# Altium schematic sheet 高压刺激电路.SchDoc
size C
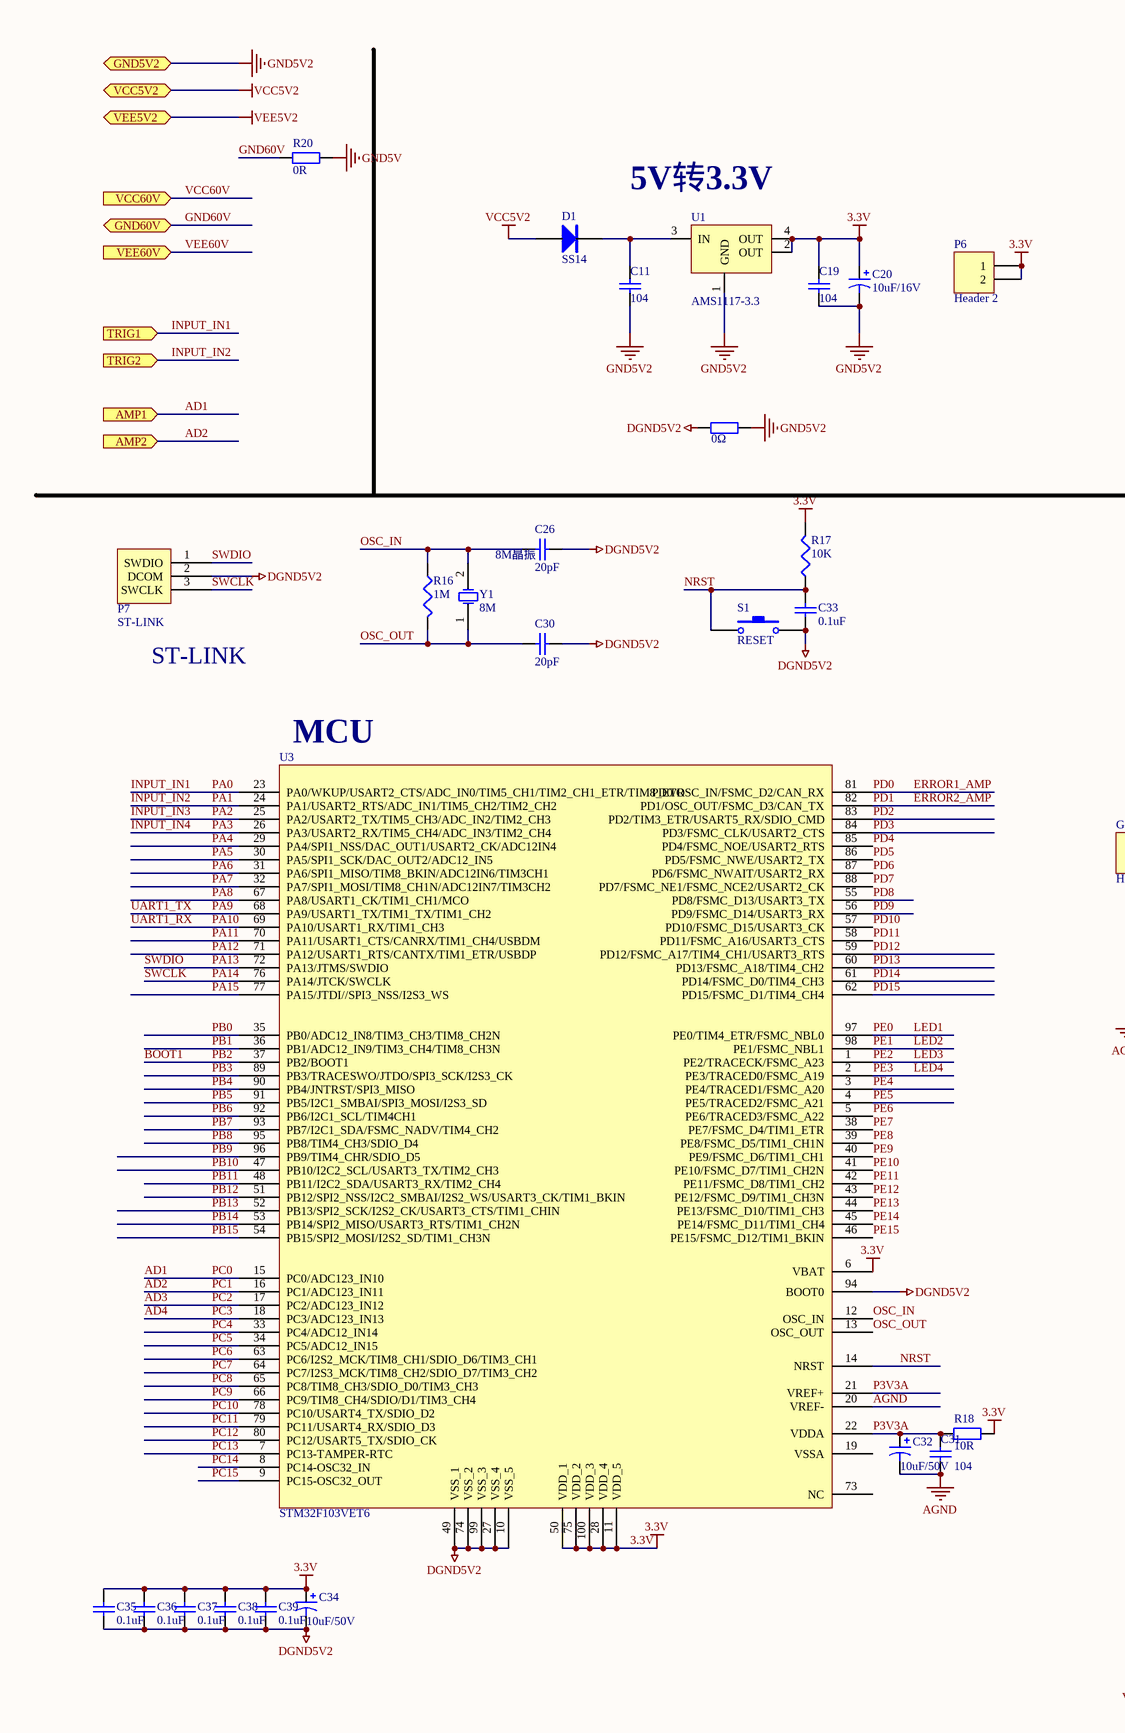
[diagram p0: 高压刺激电路.SchDoc, left]
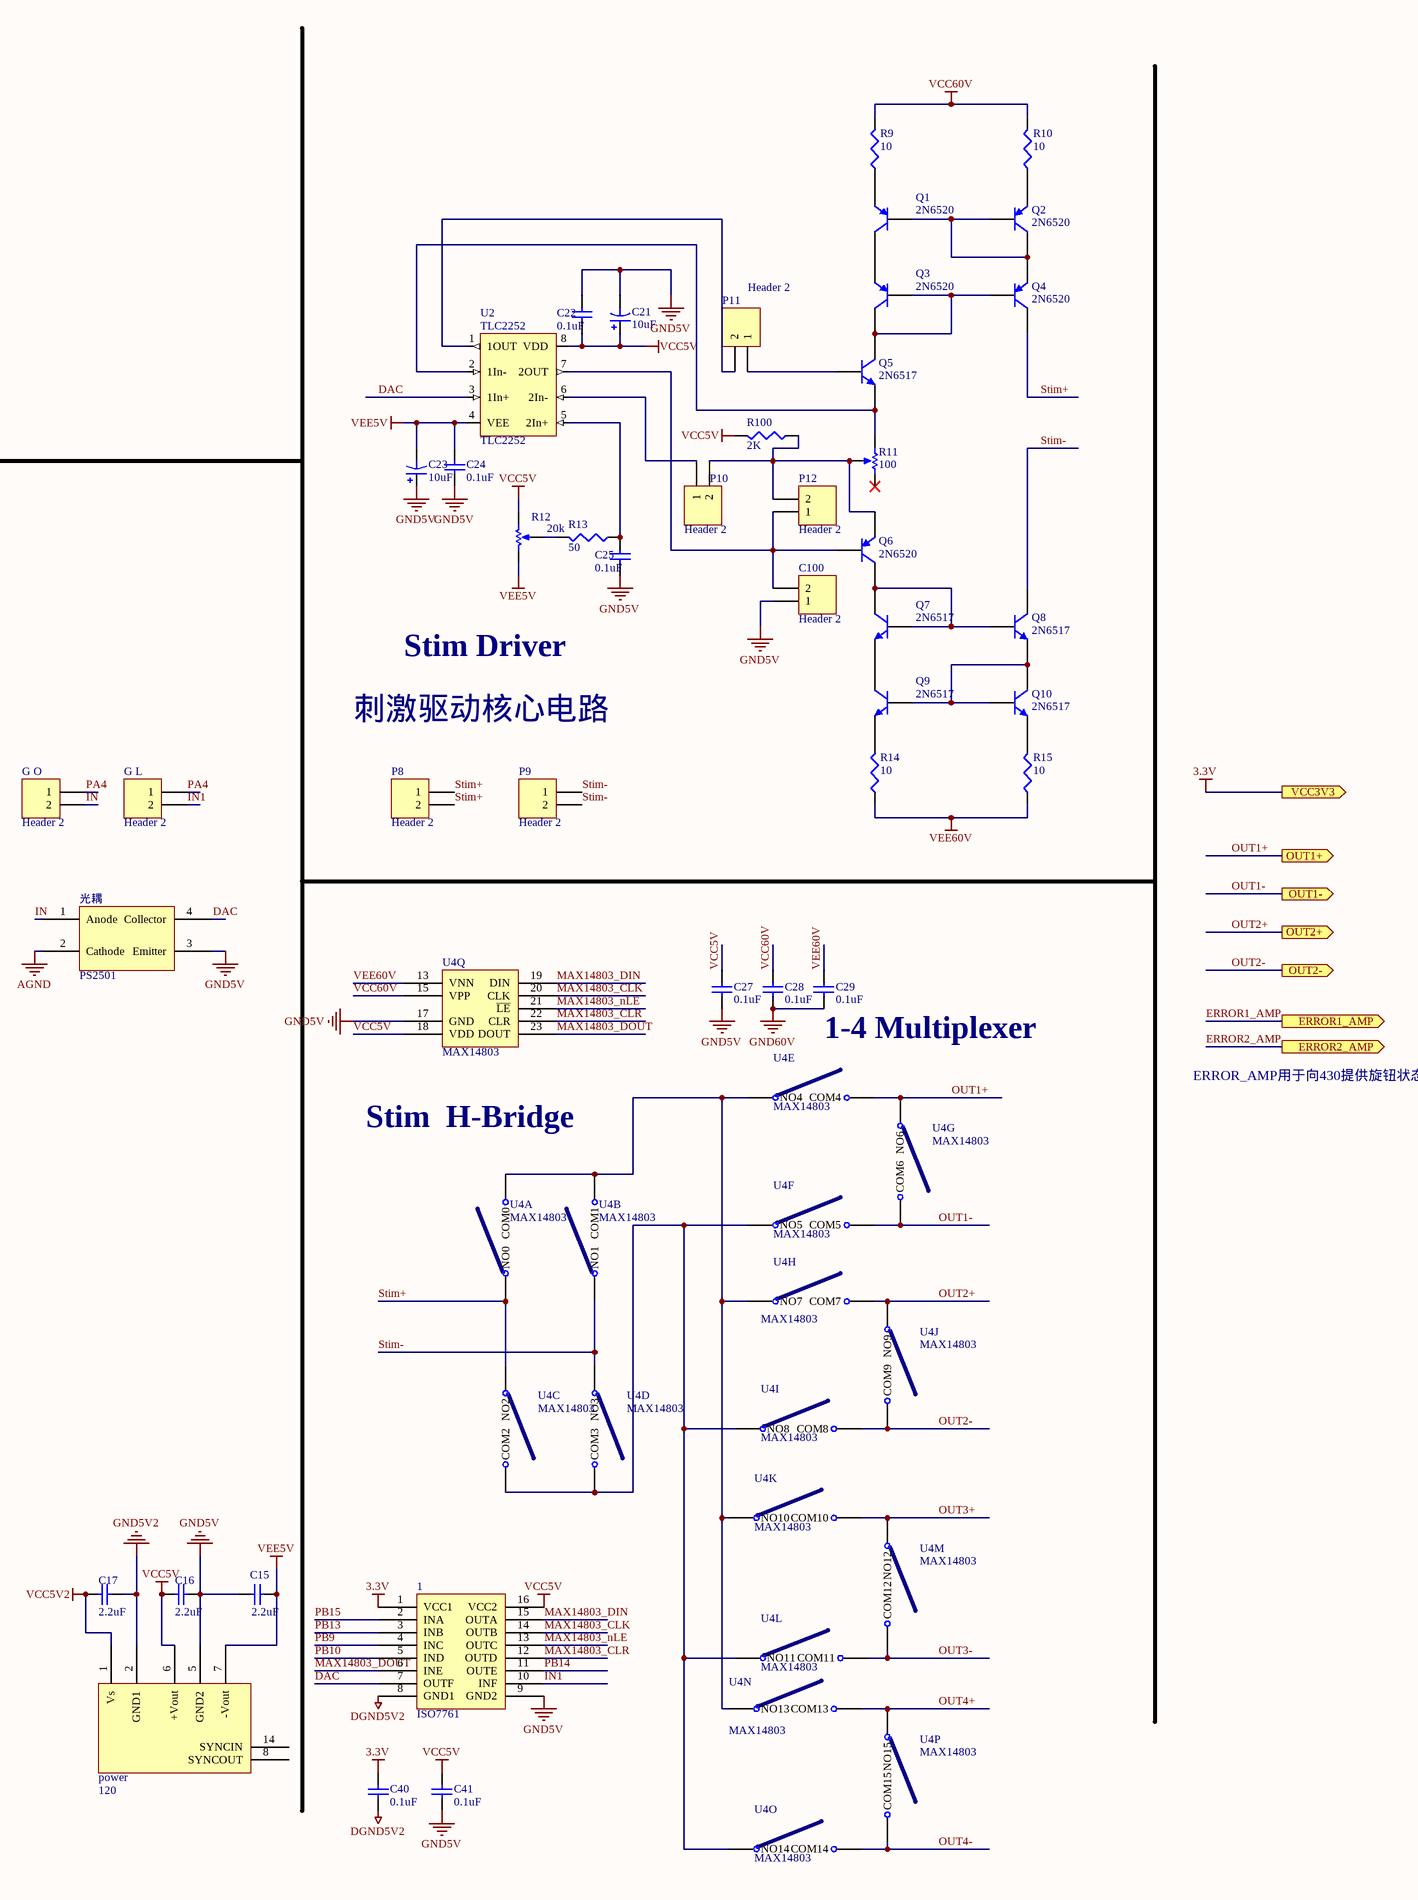
[diagram p1: 高压刺激电路.SchDoc, right]

## Parts
1  ISO7761  [ISO7761]
?  0Ω  [6-0805_M]
C11  104  [C0603]
C15  value 2.2uF  [cap0603]  (hidden comment: 2.2u)
C16  value 2.2uF  [cap0603]  (hidden comment: 2.2u)
C17  value 2.2uF  [cap0603]  (hidden comment: 2.2u)
C19  104  [C0603]
C20  10uF/16V  [C1206]
C21  value 10uF  [1206]  (hidden comment: Cap)
C22  0.1uF  [CC1608-0603]
C23  value 10uF  [1206]  (hidden comment: Cap)
C24  0.1uF  [CC1608-0603]
C25  0.1uF  [CC1608-0603]
C26  20pF  [C0603]
C27  0.1uF  [C0603]
C28  0.1uF  [C0603]
C29  0.1uF  [C0603]
C30  20pF  [C0603]
C31  104  [C0603]
C32  10uF/50V  [C0805]
C33  0.1uF  [C0603]
C34  10uF/50V  [C0805]
C35  0.1uF  [C0603]
C36  0.1uF  [C0603]
C37  0.1uF  [C0603]
C38  0.1uF  [C0603]
C39  0.1uF  [C0603]
C40  0.1uF  [C0603]
C41  0.1uF  [C0603]
C100  Header 2  [HDR1X2]
D1  SS14  [DO-214 SMA]
G_L  Header 2  [HDR1X2]
G_O  Header 2  [HDR1X2]
P6  Header 2  [HDR1X2]
P7  ST-LINK  [HDR1X3]
P8  Header 2  [HDR1X2]
P9  Header 2  [HDR1X2]
P10  Header 2  [HDR1X2]
P11  Header 2  [HDR1X2]
P12  Header 2  [HDR1X2]
power  120  [DCP010505DB(PDIP)]
Q1  2N6520  [TO-92A]
Q2  2N6520  [TO-92A]
Q3  2N6520  [TO-92A]
Q4  2N6520  [TO-92A]
Q5  2N6517  [TO-92A]
Q6  2N6520  [TO-92A]
Q7  2N6517  [TO-92A]
Q8  2N6517  [TO-92A]
Q9  2N6517  [TO-92A]
Q10  2N6517  [TO-92A]
R9  value 10  [C1608-0603]  (hidden comment: Res3)
R10  value 10  [C1608-0603]  (hidden comment: Res3)
R11  100  [VR5]
R12  20k  [VR5]
R13  value 50  [C1608-0603]  (hidden comment: Res3)
R14  value 10  [C1608-0603]  (hidden comment: Res3)
R15  value 10  [C1608-0603]  (hidden comment: Res3)
R16  1M  [J1-0603]
R17  10K  [J1-0603]
R18  10R  [R0603]
R20  0R  [R0603]
R100  value 2K  [C1608-0603]  (hidden comment: Res3)
S1  RESET  [SWITCH]
U1  AMS1117-3.3  [SOT223-4M]
U2  TLC2252  [INA128_SO8]
U3  STM32F103VET6  [LQFP100]
U4  MAX14803  [TQFP48_N]  (parts A,B,C,D,E,F,G,H,I,J,K,L,M,N,O,P,Q of 17)
Y1  8M  [BCY-W2/E4.7]
光耦  PS2501

## Ports
AMP1 (in), AMP2 (in), ERROR1_AMP (out), ERROR2_AMP (out), GND5V2, GND60V, OUT1+ (out), OUT1- (out), OUT2+ (out), OUT2- (out), TRIG1 (in), TRIG2 (in), VCC3V3 (out), VCC5V2, VCC60V (in), VEE5V2, VEE60V (in)

## Nets
3.3V: 1.1(VCC1) C19.2 C20.1 C34.1 C35.1 C36.1 C37.1 C38.1 C39.1 C40.1 P6.1 P6.2 R17.2 R18.1 U1.2(OUT) U1.4(OUT) U3.6(VBAT) U3.11(VDD_5) U3.28(VDD_4) U3.50(VDD_1) U3.75(VDD_2) U3.100(VDD_3) ; port VCC3V3
AGND: C31.1 C32.2 U3.20(VREF-) 光耦.2(Cathode)
DGND5V2: 1.8(GND1) ?.1 C26.2 C30.2 C33.1 C34.2 C35.2 C36.2 C37.2 C38.2 C39.2 C40.2 P7.2(DCOM) S1.2 U3.10(VSS_5) U3.27(VSS_4) U3.49(VSS_1) U3.74(VSS_2) U3.94(BOOT0) U3.99(VSS_3)
GND5V: 1.9(GND2) C15.1 C16.2 C21.2 C22.2 C23.1 C24.1 C25.1 C27.2 C41.2 C100.1 power.5(GND2) R20.1 U4.17(GND) 光耦.3(Emitter)
GND5V2: ?.2 C11.1 C17.2 C19.1 C20.2 power.2(GND1) U1.1(GND) ; port GND5V2
GND60V: C28.2 C29.2 R20.2 ; port GND60V
VCC5V: 1.16(VCC2) C16.1 C21.1 C22.1 C27.1 C41.1 power.6(+Vout) R12.1(TOP) R100.2 U2.8(VDD) U4.18(VDD)
VCC5V2: C17.1 D1.A power.1(Vs) ; port VCC5V2
VCC60V: C28.1 R9.2 R10.2 U4.15(VPP) ; port VCC60V
VEE5V: C15.2 C23.2 C24.2 power.7(-Vout) R12.3(BOT) U2.4(VEE)
VEE5V2: port VEE5V2
VEE60V: C29.1 R14.1 R15.1 U4.13(VNN) ; port VEE60V
AD1: U3.15(PC0/ADC123_IN10) ; port AMP1  [also labelled PC0]
AD2: U3.16(PC1/ADC123_IN11) ; port AMP2  [also labelled PC1]
AD3: U3.17(PC2/ADC123_IN12)  [also labelled PC2]
AD4: U3.18(PC3/ADC123_IN13)  [also labelled PC3]
BOOT1: U3.37(PB2/BOOT1)  [also labelled PB2]
DAC: 1.7(OUTF) U2.3(1In+) 光耦.4(Collector)
ERROR1_AMP: U3.81(PD0/OSC_IN/FSMC_D2/CAN_RX) ; port ERROR1_AMP  [also labelled PD0]
ERROR2_AMP: U3.82(PD1/OSC_OUT/FSMC_D3/CAN_TX) ; port ERROR2_AMP  [also labelled PD1]
IN: G_O.2 光耦.1(Anode)
IN1: 1.10(INF) G_L.2
INPUT_IN1: U3.23(PA0/WKUP/USART2_CTS/ADC_IN0/TIM5_CH1/TIM2_CH1_ETR/TIM8_ETR) ; port TRIG1  [also labelled PA0]
INPUT_IN2: U3.24(PA1/USART2_RTS/ADC_IN1/TIM5_CH2/TIM2_CH2) ; port TRIG2  [also labelled PA1]
INPUT_IN3: U3.25(PA2/USART2_TX/TIM5_CH3/ADC_IN2/TIM2_CH3)  [also labelled PA2]
INPUT_IN4: U3.26(PA3/USART2_RX/TIM5_CH4/ADC_IN3/TIM2_CH4)  [also labelled PA3]
LED1: U3.97(PE0/TIM4_ETR/FSMC_NBL0)  [also labelled PE0]
LED2: U3.98(PE1/FSMC_NBL1)  [also labelled PE1]
LED3: U3.1(PE2/TRACECK/FSMC_A23)  [also labelled PE2]
LED4: U3.2(PE3/TRACED0/FSMC_A19)  [also labelled PE3]
MAX14803_CLK: 1.14(OUTB) U4.20(CLK)
MAX14803_CLR: 1.12(OUTD) U4.22(CLR)
MAX14803_DIN: 1.15(OUTA) U4.19(DIN)
MAX14803_DOUT: 1.6(INE) U4.23(DOUT)
MAX14803_nLE: 1.13(OUTC) U4.21(~{LE})
NRST: C33.2 R17.1 S1.1 U3.14(NRST)
OSC_IN: C26.1 R16.2 U3.12(OSC_IN) Y1.2(OSC2)
OSC_OUT: C30.1 R16.1 U3.13(OSC_OUT) Y1.1(OSC1)
OUT1+: U4.3(COM4) U4.45(NO6) ; port OUT1+
OUT1-: U4.46(COM6) U4.48(COM5) ; port OUT1-
OUT2+: U4.40(NO9) U4.44(COM7) ; port OUT2+
OUT2-: U4.39(COM9) U4.41(COM8) ; port OUT2-
OUT3+: U4.32(NO12) U4.37(COM10)
OUT3-: U4.31(COM12) U4.34(COM11)
OUT4+: U4.26(NO15) U4.29(COM13)
OUT4-: U4.25(COM15) U4.28(COM14)
P3V3A: C31.2 C32.1 R18.2 U3.21(VREF+) U3.22(VDDA)
PA4: G_L.1 G_O.1 U3.29(PA4/SPI1_NSS/DAC_OUT1/USART2_CK/ADC12IN4)
PA5: U3.30(PA5/SPI1_SCK/DAC_OUT2/ADC12_IN5)
PA6: U3.31(PA6/SPI1_MISO/TIM8_BKIN/ADC12IN6/TIM3CH1)
PA7: U3.32(PA7/SPI1_MOSI/TIM8_CH1N/ADC12IN7/TIM3CH2)
PA8: U3.67(PA8/USART1_CK/TIM1_CH1/MCO)
PA9: U3.68(PA9/USART1_TX/TIM1_TX/TIM1_CH2)  [also labelled UART1_TX]
PA10: U3.69(PA10/USART1_RX/TIM1_CH3)  [also labelled UART1_RX]
PA11: U3.70(PA11/USART1_CTS/CANRX/TIM1_CH4/USBDM)
PA12: U3.71(PA12/USART1_RTS/CANTX/TIM1_ETR/USBDP)
PA13: P7.1(SWDIO) U3.72(PA13/JTMS/SWDIO)  [also labelled SWDIO]
PA14: P7.3(SWCLK) U3.76(PA14/JTCK/SWCLK)  [also labelled SWCLK]
PA15: U3.77(PA15/JTDI//SPI3_NSS/I2S3_WS)
PB0: U3.35(PB0/ADC12_IN8/TIM3_CH3/TIM8_CH2N)
PB1: U3.36(PB1/ADC12_IN9/TIM3_CH4/TIM8_CH3N)
PB3: U3.89(PB3/TRACESWO/JTDO/SPI3_SCK/I2S3_CK)
PB4: U3.90(PB4/JNTRST/SPI3_MISO)
PB5: U3.91(PB5/I2C1_SMBAI/SPI3_MOSI/I2S3_SD)
PB6: U3.92(PB6/I2C1_SCL/TIM4CH1)
PB7: U3.93(PB7/I2C1_SDA/FSMC_NADV/TIM4_CH2)
PB8: U3.95(PB8/TIM4_CH3/SDIO_D4)
PB9: 1.4(INC) U3.96(PB9/TIM4_CHR/SDIO_D5)
PB10: 1.5(IND) U3.47(PB10/I2C2_SCL/USART3_TX/TIM2_CH3)
PB11: U3.48(PB11/I2C2_SDA/USART3_RX/TIM2_CH4)
PB12: U3.51(PB12/SPI2_NSS/I2C2_SMBAI/I2S2_WS/USART3_CK/TIM1_BKIN)
PB13: 1.3(INB) U3.52(PB13/SPI2_SCK/I2S2_CK/USART3_CTS/TIM1_CHIN)
PB14: 1.11(OUTE) U3.53(PB14/SPI2_MISO/USART3_RTS/TIM1_CH2N)
PB15: 1.2(INA) U3.54(PB15/SPI2_MOSI/I2S2_SD/TIM1_CH3N)
PC4: U3.33(PC4/ADC12_IN14)
PC5: U3.34(PC5/ADC12_IN15)
PC6: U3.63(PC6/I2S2_MCK/TIM8_CH1/SDIO_D6/TIM3_CH1)
PC7: U3.64(PC7/I2S3_MCK/TIM8_CH2/SDIO_D7/TIM3_CH2)
PC8: U3.65(PC8/TIM8_CH3/SDIO_D0/TIM3_CH3)
PC9: U3.66(PC9/TIM8_CH4/SDIO/D1/TIM3_CH4)
PC10: U3.78(PC10/USART4_TX/SDIO_D2)
PC11: U3.79(PC11/USART4_RX/SDIO_D3)
PC12: U3.80(PC12/USART5_TX/SDIO_CK)
PC13: U3.7(PC13-TAMPER-RTC)
PC14: U3.8(PC14-OSC32_IN)
PC15: U3.9(PC15-OSC32_OUT)
PD2: U3.83(PD2/TIM3_ETR/USART5_RX/SDIO_CMD)
PD3: U3.84(PD3/FSMC_CLK/USART2_CTS)
PD4: U3.85(PD4/FSMC_NOE/USART2_RTS)
PD5: U3.86(PD5/FSMC_NWE/USART2_TX)
PD6: U3.87(PD6/FSMC_NWAIT/USART2_RX)
PD7: U3.88(PD7/FSMC_NE1/FSMC_NCE2/USART2_CK)
PD8: U3.55(PD8/FSMC_D13/USART3_TX)
PD9: U3.56(PD9/FSMC_D14/USART3_RX)
PD10: U3.57(PD10/FSMC_D15/USART3_CK)
PD11: U3.58(PD11/FSMC_A16/USART3_CTS)
PD12: U3.59(PD12/FSMC_A17/TIM4_CH1/USART3_RTS)
PD13: U3.60(PD13/FSMC_A18/TIM4_CH2)
PD14: U3.61(PD14/FSMC_D0/TIM4_CH3)
PD15: U3.62(PD15/FSMC_D1/TIM4_CH4)
PE4: U3.3(PE4/TRACED1/FSMC_A20)
PE5: U3.4(PE5/TRACED2/FSMC_A21)
PE6: U3.5(PE6/TRACED3/FSMC_A22)
PE7: U3.38(PE7/FSMC_D4/TIM1_ETR)
PE8: U3.39(PE8/FSMC_D5/TIM1_CH1N)
PE9: U3.40(PE9/FSMC_D6/TIM1_CH1)
PE10: U3.41(PE10/FSMC_D7/TIM1_CH2N)
PE11: U3.42(PE11/FSMC_D8/TIM1_CH2)
PE12: U3.43(PE12/FSMC_D9/TIM1_CH3N)
PE13: U3.44(PE13/FSMC_D10/TIM1_CH3)
PE14: U3.45(PE14/FSMC_D11/TIM1_CH4)
PE15: U3.46(PE15/FSMC_D12/TIM1_BKIN)
Stim+: P8.1 P8.2 Q4.3(C) U4.7(NO2) U4.11(NO0)
Stim-: P9.1 P9.2 Q8.3(C) U4.5(NO3) U4.10(NO1)
NetC11_2: C11.2 D1.K U1.3(IN)
NetC25_2: C25.2 R13.1 U2.5(2In+)
NetC100_2: C100.2 P12.1 Q6.2(B) U2.7(2OUT)
NetP10_1: P10.1 U2.6(2In-)
NetP10_2: P10.2 P12.2 Q6.1(E) R11.2(TAP) R100.1
NetP11_1: P11.1 Q5.2(B)
NetP11_2: P11.2 U2.1(1OUT)
NetQ1_1: Q1.1(E) R9.1
NetQ1_2: Q1.2(B) Q2.2(B) Q2.3(C) Q4.1(E)
NetQ1_3: Q1.3(C) Q3.1(E)
NetQ2_1: Q2.1(E) R10.1
NetQ3_2: Q3.2(B) Q3.3(C) Q4.2(B) Q5.3(C)
NetQ5_1: Q5.1(E) R11.1(TOP) U2.2(1In-)
NetQ6_3: Q6.3(C) Q7.2(B) Q7.3(C) Q8.2(B)
NetQ7_1: Q7.1(E) Q9.3(C)
NetQ8_1: Q8.1(E) Q9.2(B) Q10.2(B) Q10.3(C)
NetQ9_1: Q9.1(E) R14.2
NetQ10_1: Q10.1(E) R15.2
NetR12_2: R12.2(TAP) R13.2
NetU4_4: U4.4(NO4) U4.9(COM1) U4.12(COM0) U4.30(NO13) U4.38(NO10) U4.43(NO7)
NetU4_6: U4.6(COM3) U4.8(COM2) U4.27(NO14) U4.33(NO11) U4.42(NO8) U4.47(NO5)

Not connected (* = marked no-connect by the designer): power 8(SYNCOUT) 14(SYNCIN); R11 3(BOT)*; U3 19(VSSA) 73(NC)

## Notes on the sheet
- (near U1) 5V转3.3V
- 8M晶振
- ST-LINK
- (near U3) MCU
- Stim Driver
- 刺激驱动核心电路
- (near C29) 1-4 Multiplexer
- ERROR_AMP用于向430提供旋钮状态
- Stim  H-Bridge

## Library data of the parts
1 power = Component_1
? = Res2: Resistor; Value: 0; Published: 8-Jun-2000; Revision: July-2002: Re-released for DXP Platform.; Publisher: Altium Limited
C11 C19 C22 C24-C31 C33 C35-C41 = Cap Semi: Capacitor (Semiconductor SIM Model); Published: 8-Jun-2000; Publisher: Altium Limited
  C11 C19 C31: LatestRevisionDate: 29-May-2009; LatestRevisionNote: IPC-7351 Footprint Added.; PackageReference: C1206; PackageDescription: Chip Capacitor; Value: 104
  C22 C24 C25: Revision: July-2002: Re-released for DXP Platform.; Value: 0.1uF
  C26 C30: LatestRevisionDate: 29-May-2009; LatestRevisionNote: IPC-7351 Footprint Added.; PackageReference: C1206; PackageDescription: Chip Capacitor; Value: 20pF
  C27-C29 C33 C35-C41: LatestRevisionDate: 29-May-2009; LatestRevisionNote: IPC-7351 Footprint Added.; PackageReference: C1206; PackageDescription: Chip Capacitor; Value: 0.1uF
C15-C17 = Cap: Capacitor; Published: 8-Jun-2000; LatestRevisionDate: 17-Jul-2002; LatestRevisionNote: Re-released for DXP Platform.; PackageReference: RAD-0.3; Publisher: Altium Limited
C20 C21 C23 = Cap Pol1: Polarized Capacitor (Radial); Published: 8-Jun-2000; LatestRevisionDate: 17-Jul-2002; LatestRevisionNote: Re-released for DXP Platform.; PackageReference: RB7.6-15; Publisher: Altium Limited
  C20: PackageDescription: Polarized Capacitor (Radial); 2 Leads; Value: 10uF/16V
C32 C34 = Cap Pol3: Polarized Capacitor (Surface Mount); Value: 10uF/16V; Published: 8-Jun-2000; LatestRevisionDate: 29-May-2009; LatestRevisionNote: IPC-7351 Footprint Added.; PackageReference: C0805; Publisher: Altium Limited; PackageDescription: Chip Capacitor
C100 G_L G_O P6 P8-P12 = Header 2: Header, 2-Pin; LatestRevisionDate: 17-Jul-2002; LatestRevisionNote: Re-released for DXP Platform.; Publisher: Altium Limited
D1 = Diode: 1.0 Ampere Schottky Barrier Rectifiers
Q1-Q4 Q6 = 2N3906: PNP General Purpose Amplifier; Published: 8-Jun-2000; LatestRevisionDate: 15-Jan-2003; LatestRevisionNote: PCB Footprint 'BCY-W3/D4.7' replaced; DatasheetDocument: 1997; PackageDocument: Sep-1998; PackageReference: TO-92A; Publisher: Altium Limited; Code_JEDEC: TO-92A; ComponentLink1Description: Manufacturer Link; ComponentLink1URL: http://www.fairchildsemi.com/; ComponentLink2Description: Datasheet; ComponentLink2URL: http://www.fairchildsemi.com/ds/2N%2F2N3906.pdf
Q5 Q7-Q10 = 2N3904: NPN General Purpose Amplifier; Published: 8-Jun-2000; LatestRevisionDate: 15-Jan-2003; LatestRevisionNote: PCB Footprint 'BCY-W3/D4.7' replaced; DatasheetDocument: 1997; PackageDocument: Sep-1998; PackageReference: TO-92A; Publisher: Altium Limited; Code_JEDEC: TO-92A; ComponentLink1Description: Manufacturer Link; ComponentLink1URL: http://www.fairchildsemi.com/; ComponentLink2Description: Datasheet; ComponentLink2URL: http://www.fairchildsemi.com/ds/2N%2F2N3904.pdf
R9 R10 R13-R17 R100 = Res3: Resistor; Published: 8-Jun-2000; Publisher: Altium Limited
  R9 R10 R13-R15 R100: Revision: July-2002: Re-released for DXP Platform.
  R16: LatestRevisionDate: 29-May-2009; LatestRevisionNote: IPC-7351 Footprint Added.; PackageReference: J1-0603; PackageDescription: Chip Resistor; Value: 1M
  R17: LatestRevisionDate: 29-May-2009; LatestRevisionNote: IPC-7351 Footprint Added.; PackageReference: J1-0603; PackageDescription: Chip Resistor; Value: 10K
R11 R12 = ResVari
R18 R20 = Res2: Resistor; Value: 1K; Published: 8-Jun-2000; LatestRevisionDate: 17-Jul-2002; LatestRevisionNote: Re-released for DXP Platform.; PackageReference: AXIAL-0.4; Publisher: Altium Limited; PackageDescription: Axial Device, Thru-Hole; 2 Leads; 0.4 in Pin Spacing
S1 = SW-PB: Switch-按键; pin to pad: 2>4; Published: 24-Mar-1999; LatestRevisionDate: 17-Jul-2002; LatestRevisionNote: Re-released for DXP Platform.; PackageReference: SPST-2; Publisher: Altium Limited; PackageDescription: Switch; 2 Leads
U1 = AMS1117
Y1 = XTAL: Crystal Oscillator; Published: 8-Jun-2000; LatestRevisionDate: 17-Jul-2002; LatestRevisionNote: Re-released for DXP Platform.; PackageReference: R38; Publisher: Altium Limited; PackageDescription: Crystal, Thru-Hole; 2 Leads; Body 3.1 x 8.2 mm (Dia.xH)